# Altium project Cosmic_Nova_Board_Alpha_V0.00.PrjPcb
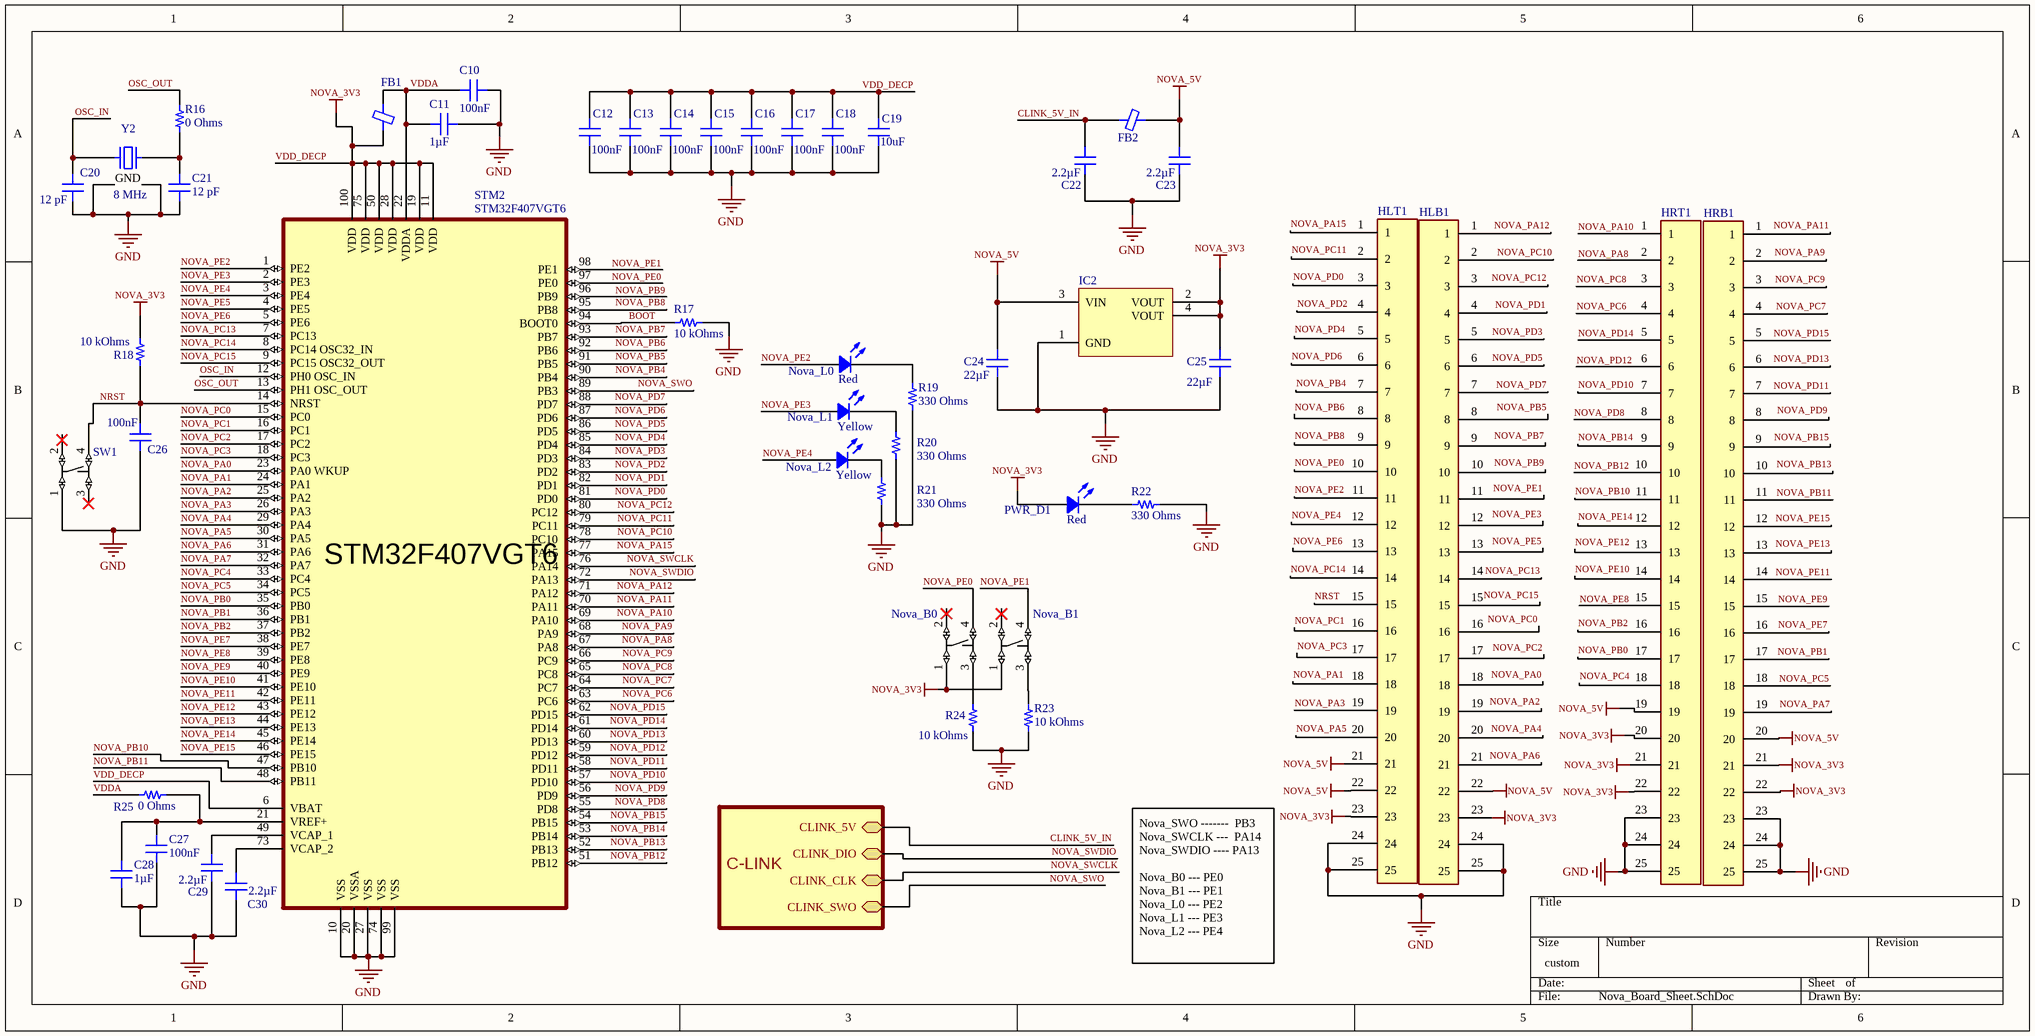
[diagram p0: Nova_Board_Sheet.SchDoc]
2 sheets, 83 parts. Net scope: hierarchical (ports join the sheet entries above them; power ports are global).
Board file: Nova_Board_PCB_D0.PcbDoc
Sheets:
  Nova_Board_Sheet.SchDoc
    U_Cosmolink_Sheet = Cosmolink_Sheet.SchDoc

## Sheet Nova_Board_Sheet.SchDoc
size 381 x 193 mm

### Parts
C10  Capacitance: 100nF  [CAP 0603_1608]  (hidden comment: 0.1µF)
C11  1µF  [CAP 0603_1608]
C12  Capacitance: 100nF  [CAP 0603_1608]  (hidden comment: 0.1µF)
C13  Capacitance: 100nF  [CAP 0603_1608]  (hidden comment: 0.1µF)
C14  Capacitance: 100nF  [CAP 0603_1608]  (hidden comment: 0.1µF)
C15  Capacitance: 100nF  [CAP 0603_1608]  (hidden comment: 0.1µF)
C16  Capacitance: 100nF  [CAP 0603_1608]  (hidden comment: 0.1µF)
C17  Capacitance: 100nF  [CAP 0603_1608]  (hidden comment: 0.1µF)
C18  Capacitance: 100nF  [CAP 0603_1608]  (hidden comment: 0.1µF)
C19  Capacitance: 10uF  [CAP 0603_1608]  (hidden comment: 10µF)
C20  12 pF  [CAP 0603_1608]
C21  12 pF  [CAP 0603_1608]
C22  2.2µF  [CAP 0603_1608]
C23  2.2µF  [CAP 0603_1608]
C24  22µF  [CAP 0805_2012]
C25  22µF  [CAP 0805_2012]
C26  Capacitance: 100nF  [CAP 0603_1608]  (hidden comment: 0.1µF)
C27  Capacitance: 100nF  [CAP 0603_1608]  (hidden comment: 0.1µF)
C28  1µF  [CAP 0603_1608]
C29  2.2µF  [CAP 0603_1608]
C30  2.2µF  [CAP 0603_1608]
FB1  600 Ohms @ 100MHz  [FER 0603_1608]  (value not drawn)
FB2  600 Ohms @ 100MHz  [FER 0603_1608]  (value not drawn)
HLB1  2.54mm_TH_1x25_pin_header  [2.54mm_TH_1x25_pin_header]  (value not drawn)
HLT1  2.54mm_TH_1x25_pin_header  [2.54mm_TH_1x25_pin_header]  (value not drawn)
HRB1  2.54mm_TH_1x25_pin_header  [2.54mm_TH_1x25_pin_header]  (value not drawn)
HRT1  2.54mm_TH_1x25_pin_header  [2.54mm_TH_1x25_pin_header]  (value not drawn)
IC2  LDL1117S33R  [ST SOT-223]  (value not drawn)
Nova_B0  3x4x2.5_oval_switch  [3x4x2.5_oval_button_footprint]  (value not drawn)
Nova_B1  3x4x2.5_oval_switch  [3x4x2.5_oval_button_footprint]  (value not drawn)
Nova_L0  Red  [LED 0603_1608 RED]
Nova_L1  Yellow  [LED 0603_1608 YELLOW]
Nova_L2  Yellow  [LED 0603_1608 YELLOW]
PWR_D1  Red  [LED 0603_1608 RED]
R16  0 Ohms  [RES 0603_1608]
R17  10 kOhms  [RES 0603_1608]
R18  10 kOhms  [RES 0603_1608]
R19  330 Ohms  [RES 0603_1608]
R20  330 Ohms  [RES 0603_1608]
R21  330 Ohms  [RES 0603_1608]
R22  330 Ohms  [RES 0603_1608]
R23  10 kOhms  [RES 0603_1608]
R24  10 kOhms  [RES 0603_1608]
R25  0 Ohms  [RES 0603_1608]
STM2  STM32F407VGT6  [STM32F407VGT6_FOOTPRINT]
SW1  3x4x2.5_oval_switch  [3x4x2.5_oval_button_footprint]  (value not drawn)
Y2  8 MHz  [EPSON TSX-3225]

### Sub-sheets
U_Cosmolink_Sheet = Cosmolink_Sheet.SchDoc: CLINK_CLK (bidir), CLINK_DIO (bidir), CLINK_5V (bidir), CLINK_SWO (bidir)

### Nets
CLINK_5V_IN: C22.1 FB2.2 ; sheet U_Cosmolink_Sheet/CLINK_5V
GND: C10.1 C11.1 C12.2 C13.2 C14.2 C15.2 C16.2 C17.2 C18.2 C19.1 C20.1 C21.1 C22.2 C23.2 C24.1 C25.1 C26.1 C27.2 C28.2 C29.2 C30.2 HLB1.24 HLB1.25 HLT1.24 HLT1.25 HRB1.23 HRB1.24 HRB1.25 HRT1.23 HRT1.24 HRT1.25 IC2.1(GND) R17.1 R19.1 R20.1 R21.1 R22.2 R23.2 R24.2 STM2.10(VSS) STM2.20(VSSA) STM2.27(VSS) STM2.74(VSS) STM2.99(VSS) SW1.1 Y2.2(GND) Y2.4(GND)
NOVA_5V: C23.1 C24.2 FB2.1 HLB1.22 HLT1.21 HLT1.22 HRB1.20 HRT1.19 IC2.3(VIN)
VDD_DECP: C12.1 C13.1 C14.1 C15.1 C16.1 C17.1 C18.1 C19.2 C25.2 FB1.1 HLB1.23 HLT1.23 HRB1.21 HRB1.22 HRT1.20 HRT1.21 HRT1.22 IC2.2(VOUT) IC2.4(VOUT) Nova_B0.1 Nova_B1.1 PWR_D1.1 R18.1 STM2.6(VBAT) STM2.11(VDD) STM2.19(VDD) STM2.28(VDD) STM2.50(VDD) STM2.75(VDD) STM2.100(VDD)  [also labelled NOVA_3V3]
BOOT: R17.2 STM2.94(BOOT0)
NOVA_PA0: HLB1.18 STM2.23(PA0_WKUP)
NOVA_PA1: HLT1.18 STM2.24(PA1)
NOVA_PA2: HLB1.19 STM2.25(PA2)
NOVA_PA3: HLT1.19 STM2.26(PA3)
NOVA_PA4: HLB1.20 STM2.29(PA4)
NOVA_PA5: HLT1.20 STM2.30(PA5)
NOVA_PA6: HLB1.21 STM2.31(PA6)
NOVA_PA7: HRB1.19 STM2.32(PA7)
NOVA_PA8: HRT1.2 STM2.67(PA8)
NOVA_PA9: HRB1.2 STM2.68(PA9)
NOVA_PA10: HRT1.1 STM2.69(PA10)
NOVA_PA11: HRB1.1 STM2.70(PA11)
NOVA_PA12: HLB1.1 STM2.71(PA12)
NOVA_PA15: HLT1.1 STM2.77(PA15)
NOVA_PB0: HRT1.17 STM2.35(PB0)
NOVA_PB1: HRB1.17 STM2.36(PB1)
NOVA_PB2: HRT1.16 STM2.37(PB2)
NOVA_PB4: HLT1.7 STM2.90(PB4)
NOVA_PB5: HLB1.8 STM2.91(PB5)
NOVA_PB6: HLT1.8 STM2.92(PB6)
NOVA_PB7: HLB1.9 STM2.93(PB7)
NOVA_PB8: HLT1.9 STM2.95(PB8)
NOVA_PB9: HLB1.10 STM2.96(PB9)
NOVA_PB10: HRT1.11 STM2.47(PB10)
NOVA_PB11: HRB1.11 STM2.48(PB11)
NOVA_PB12: HRT1.10 STM2.51(PB12)
NOVA_PB13: HRB1.10 STM2.52(PB13)
NOVA_PB14: HRT1.9 STM2.53(PB14)
NOVA_PB15: HRB1.9 STM2.54(PB15)
NOVA_PC0: HLB1.16 STM2.15(PC0)
NOVA_PC1: HLT1.16 STM2.16(PC1)
NOVA_PC2: HLB1.17 STM2.17(PC2)
NOVA_PC3: HLT1.17 STM2.18(PC3)
NOVA_PC4: HRT1.18 STM2.33(PC4)
NOVA_PC5: HRB1.18 STM2.34(PC5)
NOVA_PC6: HRT1.4 STM2.63(PC6)
NOVA_PC7: HRB1.4 STM2.64(PC7)
NOVA_PC8: HRT1.3 STM2.65(PC8)
NOVA_PC9: HRB1.3 STM2.66(PC9)
NOVA_PC10: HLB1.2 STM2.78(PC10)
NOVA_PC11: HLT1.2 STM2.79(PC11)
NOVA_PC12: HLB1.3 STM2.80(PC12)
NOVA_PC13: HLB1.14 STM2.7(PC13)
NOVA_PC14: HLT1.14 STM2.8(PC14_OSC32_IN)
NOVA_PC15: HLB1.15 STM2.9(PC15_OSC32_OUT)
NOVA_PD0: HLT1.3 STM2.81(PD0)
NOVA_PD1: HLB1.4 STM2.82(PD1)
NOVA_PD2: HLT1.4 STM2.83(PD2)
NOVA_PD3: HLB1.5 STM2.84(PD3)
NOVA_PD4: HLT1.5 STM2.85(PD4)
NOVA_PD5: HLB1.6 STM2.86(PD5)
NOVA_PD6: HLT1.6 STM2.87(PD6)
NOVA_PD7: HLB1.7 STM2.88(PD7)
NOVA_PD8: HRT1.8 STM2.55(PD8)
NOVA_PD9: HRB1.8 STM2.56(PD9)
NOVA_PD10: HRT1.7 STM2.57(PD10)
NOVA_PD11: HRB1.7 STM2.58(PD11)
NOVA_PD12: HRT1.6 STM2.59(PD12)
NOVA_PD13: HRB1.6 STM2.60(PD13)
NOVA_PD14: HRT1.5 STM2.61(PD14)
NOVA_PD15: HRB1.5 STM2.62(PD15)
NOVA_PE0: HLT1.10 Nova_B0.4 STM2.97(PE0)
NOVA_PE1: HLB1.11 Nova_B1.4 STM2.98(PE1)
NOVA_PE2: HLT1.11 Nova_L0.1 STM2.1(PE2)
NOVA_PE3: HLB1.12 Nova_L1.1 STM2.2(PE3)
NOVA_PE4: HLT1.12 Nova_L2.1 STM2.3(PE4)
NOVA_PE5: HLB1.13 STM2.4(PE5)
NOVA_PE6: HLT1.13 STM2.5(PE6)
NOVA_PE7: HRB1.16 STM2.38(PE7)
NOVA_PE8: HRT1.15 STM2.39(PE8)
NOVA_PE9: HRB1.15 STM2.40(PE9)
NOVA_PE10: HRT1.14 STM2.41(PE10)
NOVA_PE11: HRB1.14 STM2.42(PE11)
NOVA_PE12: HRT1.13 STM2.43(PE12)
NOVA_PE13: HRB1.13 STM2.44(PE13)
NOVA_PE14: HRT1.12 STM2.45(PE14)
NOVA_PE15: HRB1.12 STM2.46(PE15)
NOVA_SWCLK: STM2.76(PA14) ; sheet U_Cosmolink_Sheet/CLINK_CLK
NOVA_SWDIO: STM2.72(PA13) ; sheet U_Cosmolink_Sheet/CLINK_DIO
NOVA_SWO: STM2.89(PB3) ; sheet U_Cosmolink_Sheet/CLINK_SWO
NRST: C26.2 HLT1.15 R18.2 STM2.14(NRST) SW1.4
OSC_IN: C20.2 STM2.12(PH0_OSC_IN) Y2.1
OSC_OUT: R16.2 STM2.13(PH1_OSC_OUT)
VDDA: C10.2 C11.2 FB1.2 R25.1 STM2.22(VDDA)
NetC21_2: C21.2 R16.1 Y2.3
NetC27_1: C27.1 C28.1 R25.2 STM2.21(VREF+)
NetC29_1: C29.1 STM2.49(VCAP_1)
NetC30_1: C30.1 STM2.73(VCAP_2)
NetNova_B0_3: Nova_B0.3 R24.1
NetNova_B1_3: Nova_B1.3 R23.1
NetNova_L0_2: Nova_L0.2 R19.2
NetNova_L1_2: Nova_L1.2 R20.2
NetNova_L2_2: Nova_L2.2 R21.2
NetPWR_D1_2: PWR_D1.2 R22.1

Not connected (* = marked no-connect by the designer): Nova_B0 2*; Nova_B1 2*; SW1 2* 3*

### Notes on the sheet
- C-LINK
- Nova_SWO -------  PB3
  Nova_SWCLK ---  PA14
  Nova_SWDIO ---- PA13
  Nova_B0 --- PE0
  Nova_B1 --- PE1
  Nova_L0 --- PE2
  Nova_L1 --- PE3
  Nova_L2 --- PE4

### Library data of the parts
C10-C19 C22 C23 C26-C30 = 06031C104KAT2A: CAP CER 0.1UF 100V X7R 0603; manufacturer: AVX Corporation; Tolerance: ±10%; Part Number: 06031C104KAT2A; Applications: General Purpose; componentlink1description: Datasheet; componentlink1url: http://datasheets.avx.com/X7RDielectric.pdf; componentlink2description: DigiKey Link; componentlink2url: http://digikey.com/product-detail/en/avx-corporation/06031C104KAT2A/478-10047-1-ND/6564270; Device Package: 0603 (1608 Metric); lastupdated: 9/2/2020 1:03:14 AM; Lifecycle Status: Active; Minimum Order: 1; Mounting Type: Surface Mount, MLCC; Operating Temperature: -55°C ~ 125°C; Package / Case: 0603 (1608 Metric); packaging: TapeAndReel; partid: 14077; Part Status: Active; price: 0.03; series: -; Size / Dimension: 0.063" L x 0.032" W (1.60mm x 0.81mm); Supplier 1: DigiKey; Supplier Part Number 1: 478-10047-1-ND; Temperature Coefficient: X7R; Thickness (Max): 0.037" (0.94mm); Voltage - Rated: 100V
  C10 C12-C18 C26 C27: value: 0.1µF
  C11 C28: Capacitance: 1µF; value: 1µF
  C19: value: 10µF
  C22 C23 C29 C30: Capacitance: 2.2µF; value: 2.2µF
C20 C21 = C06CF220F-9ZN-X0T: HIGH-Q MLCC (CF): 0603, 22 PF (1; manufacturer: Knowles Dielectric Labs; Temperature Coefficient: C0G, NP0; Tolerance: ±1%; Voltage - Rated: 250V; Part Number: C06CF220F-9ZN-X0T; Capacitance: 12 pF; Applications: RF, Microwave, High Frequency; componentlink1description: Datasheet; componentlink1url: https://media.digikey.com/pdf/Data%20Sheets/Knowles%20Dielectric%20Labs%20PDFs/MLC_SLC_Cap_Cat.pdf; componentlink2description: DigiKey Link; componentlink2url: https://www.digikey.com/en/products/detail/knowles-dielectric-labs/C06CF220F-9ZN-X0T/19203937; Device Package: 0603 (1608 Metric); Features: High Q, Low Loss; lastupdated: 2/9/2024 8:08:55 PM; Lifecycle Status: Active; Minimum Order: 1; Mounting Type: Surface Mount, MLCC; Operating Temperature: -55°C ~ 125°C; Package / Case: 0603 (1608 Metric); packaging: TapeAndReel; partid: 55085; Part Status: Active; price: 2.56; series: CF; Size / Dimension: 0.060" L x 0.030" W (1.52mm x 0.76mm); Supplier 1: DigiKey; Supplier Part Number 1: 1761-C06CF220F-9ZN-X0TCT-ND; Thickness (Max): 0.031" (0.80mm); value: 12 pF
C24 C25 = 0805ZD226MAT2A: CAP CER 22UF 10V X5R 0805; manufacturer: AVX Corporation; Tolerance: ±20%; Part Number: 0805ZD226MAT2A; Capacitance: 22µF; Applications: General Purpose; componentlink1description: Datasheet; componentlink1url: http://datasheets.avx.com/cx5r.pdf; componentlink2description: DigiKey Link; componentlink2url: http://digikey.com/product-detail/en/avx-corporation/0805ZD226MAT2A/478-7966-1-ND/3881589; Device Package: 0805 (2012 Metric); lastupdated: 9/2/2020 1:04:32 AM; Lifecycle Status: Active; Minimum Order: 1; Mounting Type: Surface Mount, MLCC; Operating Temperature: -55°C ~ 85°C; Package / Case: 0805 (2012 Metric); packaging: TapeAndReel; partid: 7750; Part Status: Active; price: 0.10; series: -; Size / Dimension: 0.079" L x 0.049" W (2.00mm x 1.25mm); Supplier 1: DigiKey; Supplier Part Number 1: 478-7966-1-ND; Temperature Coefficient: X5R; Thickness (Max): 0.060" (1.52mm); value: 22µF; Voltage - Rated: 10V
FB1 FB2 = BLM18DN601SZ1D: FERRITEBEAD SMD Z100MHZ=600OHM 7; Manufacturer: Murata Electronics; Current Rating (Max): 700mA; Number of Lines: 1; Part Number: BLM18DN601SZ1D; ComponentLink1Description: Datasheet; ComponentLink1URL: https://www.murata.com/en-us/api/pdfdownloadapi?cate=luNoiseSupprFilteChipFerriBead&partno=BLM18DN601SZ1%23; ComponentLink2Description: DigiKey Link; ComponentLink2URL: http://digikey.com/product-detail/en/murata-electronics/BLM18DN601SZ1D/490-18575-1-ND/10135586; Device Package: 0603 (1608 Metric); Height (Max): 0.037" (0.95mm); Impedance @ Frequency: 600 Ohms @ 100MHz; LastUpdated: 9/2/2020 1:18:18 AM; Lifecycle Status: Active; Minimum Order: 1; Mounting Type: Surface Mount; Operating Temperature: -55°C ~ 125°C; Package / Case: 0603 (1608 Metric); Packaging: TapeAndReel; PartId: 783; Part Status: Active; Price: 0.05; Ratings: AEC-Q200; Series: EMIFIL®, BLM18; Size / Dimension: 0.063" L x 0.031" W (1.60mm x 0.80mm); Supplier 1: DigiKey; Supplier Part Number 1: 490-18575-1-ND; Value: 600 Ohms @ 100MHz
IC2 = LDL1117S33R: IC REG LINEAR 3.3V 1.2A SOT223; Manufacturer: STMicroelectronics; Current - Quiescent (Iq): 500 µA; Number of Regulators: 1; Output Configuration: Positive; Output Type: Fixed; Protection Features: Over Current, Over Temperature, Under Voltage Lockout (UVLO); PSRR: 87dB ~ 65dB (120Hz ~ 100kHz); Voltage Dropout (Max): 0.6V @ 1.2A; Voltage - Input (Max): 18V; Part Number: LDL1117S33R; ComponentLink1Description: Datasheet; ComponentLink1URL: http://www.st.com/content/ccc/resource/technical/document/datasheet/group3/0e/5a/00/ca/10/1a/4f/a5/DM00366442/files/DM00366442.pdf/jcr:content/translations/en.DM00366442.pdf; ComponentLink2Description: DigiKey Link; ComponentLink2URL: https://www.digikey.com/en/products/detail/stmicroelectronics/LDL1117S33R/7102071; Current - Output: 1.2A; LastUpdated: 6/3/2024 8:25:59 PM; Lifecycle Status: Active; Minimum Order: 1; Mounting Type: Surface Mount; Operating Temperature: -40°C ~ 125°C (TJ); Package / Case: TO-261-4, TO-261AA; Packaging: TapeAndReel; Part Status: Active; Price: 0.31; Series: -; Supplier 1: DigiKey; Supplier Part Number 1: 497-17239-1-ND; Supplier Device Package: SOT-223; Voltage - Output (Min/Fixed): 3.3V
Nova_L0 PWR_D1 = VFHR1111C-3BY2A-TR: LED RED DIFFUSED 1608 SMD; Manufacturer: Stanley Electric Co; Configuration: Standard; Current - Test: 20mA; Lens Color: White; Lens Size: 1.10mm x 0.80mm; Lens Style: Rectangle with Flat Top; Millicandela Rating: 91mcd; Viewing Angle: 140°; Voltage - Forward (Vf) (Typ): 1.9V; Wavelength - Dominant: 626nm; Wavelength - Peak: 635nm; Part Number: VFHR1111C-3BY2A-TR; Color: Red; ComponentLink1Description: Datasheet; ComponentLink1URL: http://www.stanley-components.com/php/downloaddatafile.php?rp=0,VFHR1111C-3BY2A-TR_e.pdf; ComponentLink2Description: DigiKey Link; ComponentLink2URL: https://www.digikey.com/en/products/detail/stanley-electric-co/VFHR1111C-3BY2A-TR/6615658; Device Package: 0603 (1608 Metric); Height (Max): 0.80mm; LastUpdated: 6/3/2024 7:59:48 PM; Lens Transparency: Diffused; Lifecycle Status: Active; Minimum Order: 1; Mounting Type: Surface Mount; Package / Case: 0603 (1608 Metric); Packaging: TapeAndReel; PartId: 373; Part Status: Active; Price: 0.06; Series: -; Size / Dimension: 1.60mm L x 0.80mm W; Supplier 1: DigiKey; Supplier Part Number 1: 404-1310-1-ND; Supplier Device Package: 1608; Value: Red
Nova_L1 Nova_L2 = 5973405507F: LED YELLOW 0603 SMD; Manufacturer: Dialight; Configuration: Standard; Current - Test: 20mA; Lens Color: 0.68mm; Lens Size: 1.20mm x 0.80mm; Lens Style: Rectangle with Flat Top; Millicandela Rating: 224mcd; Voltage - Forward (Vf) (Typ): 2.1V; Wavelength - Dominant: 590nm; Part Number: 5973405507F; Color: Yellow; ComponentLink1Description: Datasheet; ComponentLink1URL: http://www.dialightsignalsandcomponents.com/Assets/Drawings/2D_Drawings_DrawingDetailedSpec/NewDrawings/18369A.pdf; ComponentLink2Description: DigiKey Link; ComponentLink2URL: https://www.digikey.com/en/products/detail/dialight/5973405507F/9385433; Device Package: 0603 (1608 Metric); Height (Max): 0.68mm; LastUpdated: 6/3/2024 8:01:10 PM; Lifecycle Status: Active; Minimum Order: 1; Mounting Type: Surface Mount; Package / Case: 0603 (1608 Metric); Packaging: TapeAndReel; PartId: 87; Part Status: Active; Price: 0.08; Series: 597; Size / Dimension: 1.60mm L x 0.80mm W; Supplier 1: DigiKey; Supplier Part Number 1: 350-4378-1-ND; Supplier Device Package: 0603; Value: Yellow
R16 R25 = TLRZ1JTTD: RES 0 OHM JUMPER 0603; Manufacturer: KOA Speer Electronics, Inc.; Part Number: TLRZ1JTTD; Value: 0 Ohms; ComponentLink1Description: Datasheet; ComponentLink1URL: http://www.koaspeer.com/catimages/Products/TLRZ/TLRZ.pdf; ComponentLink2Description: DigiKey Link; ComponentLink2URL: https://www.digikey.com/en/products/detail/koa-speer-electronics-inc/TLRZ1JTTD/9845493; Composition: Metal Element; Device Package: 0603 (1608 Metric); Features: Automotive AEC-Q200, Current Sense; Height - Seated (Max): 0.022" (0.55mm); LastUpdated: 2/9/2024 8:43:37 PM; Lifecycle Status: Active; Minimum Order: 1; Number of Terminations: 2; Operating Temperature: -55°C ~ 170°C; Package / Case: 0603 (1608 Metric); Packaging: TapeAndReel; PartId: 4851; Part Status: Active; Price: 0.08; Ratings: AEC-Q200; Resistance: 0 Ohms; Series: TLRZ; Size / Dimension: 0.063" L x 0.031" W (1.60mm x 0.80mm); Supplier 1: DigiKey; Supplier Part Number 1: 2019-TLRZ1JTTDCT-ND; Supplier Device Package: 0603; Tolerance: Jumper
R17 R18 R23 R24 = RNCS0603BKE10K0: RES 10K OHM 0.1% 1/16W 0603; Manufacturer: Stackpole Electronics Inc; Power (Watts): 0.063W, 1/16W; Temperature Coefficient: ±25ppm/°C; Part Number: RNCS0603BKE10K0; Value: 10 kOhms; ComponentLink1Description: Datasheet; ComponentLink1URL: https://www.seielect.com/catalog/sei-rncs_rnch.pdf; ComponentLink2Description: DigiKey Link; ComponentLink2URL: https://www.digikey.com/en/products/detail/stackpole-electronics-inc/RNCS0603BKE10K0/1708836; Composition: Thin Film; Device Package: 0603 (1608 Metric); Features: Anti-Corrosive, Automotive AEC-Q200, Moisture Resistant; Height - Seated (Max): 0.022" (0.55mm); LastUpdated: 2/9/2024 8:43:37 PM; Lifecycle Status: Active; Minimum Order: 1; Number of Terminations: 2; Operating Temperature: -55°C ~ 155°C; Package / Case: 0603 (1608 Metric); Packaging: TapeAndReel; PartId: 4838; Part Status: Active; Price: 0.06; Ratings: AEC-Q200; Resistance: 10 kOhms; Series: RNCS; Size / Dimension: 0.061" L x 0.031" W (1.55mm x 0.80mm); Supplier 1: DigiKey; Supplier Part Number 1: RNCS0603BKE10K0CT-ND; Supplier Device Package: 0603; Tolerance: ±0.1%
R19-R22 = RNCS0603BKE10K0: RES 10K OHM 0.1% 1/16W 0603; Manufacturer: Stackpole Electronics Inc; Power (Watts): 0.063W, 1/16W; Resistance: 100 kOhms; Temperature Coefficient: ±25ppm/°C; Part Number: RNCS0603BKE10K0; Value: 330 Ohms; ComponentLink1Description: Datasheet; ComponentLink1URL: https://www.seielect.com/catalog/sei-rncs_rnch.pdf; ComponentLink2Description: DigiKey Link; ComponentLink2URL: https://www.digikey.com/en/products/detail/stackpole-electronics-inc/RNCS0603BKE10K0/1708836; Composition: Thin Film; Device Package: 0603 (1608 Metric); Features: Anti-Corrosive, Automotive AEC-Q200, Moisture Resistant; Height - Seated (Max): 0.022" (0.55mm); LastUpdated: 2/9/2024 8:43:37 PM; Lifecycle Status: Active; Minimum Order: 1; Number of Terminations: 2; Operating Temperature: -55°C ~ 155°C; Package / Case: 0603 (1608 Metric); Packaging: TapeAndReel; PartId: 4838; Part Status: Active; Price: 0.06; Ratings: AEC-Q200; Series: RNCS; Size / Dimension: 0.061" L x 0.031" W (1.55mm x 0.80mm); Supplier 1: DigiKey; Supplier Part Number 1: RNCS0603BKE10K0CT-ND; Supplier Device Package: 0603; Tolerance: ±0.1%
STM2 = STM32F407VGT6: 1MB 1.8V~3.6V ARM-M4 192KB 168MHz FLASH 82 LQFP-100(14x14) Microcontrollers (MCU/MPU/SOC) ROHS; JLCPCB Part #: C12345; Package: LQFP-100(14x14); MFR.Part #: STM32F407VGT6; ComponentLink1Description: Datasheet; ComponentLink1URL: https://www.st.com/resource/en/datasheet/dm00037051.pdf; ComponentLink2Description: JLCPCB Parts; ComponentLink2URL: https://jlcpcb.com/partdetail/Stmicroelectronics-STM32F407VGT6/C12345
Y2 = TSX-3225 16.0000MF10U-B0: CRYSTAL 16.0000MHZ 16PF SMD; Manufacturer: EPSON; ESR (Equivalent Series Resistance): 60 Ohms; Frequency: 16 MHz; Frequency Stability: ±10ppm; Operating Mode: Fundamental; Part Number: TSX-3225 16.0000MF10U-B0; ComponentLink1Description: Datasheet; ComponentLink1URL: https://support.epson.biz/td/api/doc_check.php?dl=brief_TSX-3225&lang=en; ComponentLink2Description: DigiKey Link; ComponentLink2URL: https://www.digikey.com/en/products/detail/epson/TSX-3225-16-0000MF10U-B0/5260851; Frequency Tolerance: ±10ppm; Height - Seated (Max): 0.024" (0.60mm); LastUpdated: 6/3/2024 8:02:15 PM; Lifecycle Status: Active; Load Capacitance: 16pF; Minimum Order: 1; Mounting Type: Surface Mount; Operating Temperature: -10°C ~ 60°C; Package / Case: 4-SMD, No Lead; Packaging: TapeAndReel; PartId: 436; Part Status: Active; Price: 0.20; Series: TSX-3225; Size / Dimension: 0.126" L x 0.098" W (3.20mm x 2.50mm); Supplier 1: DigiKey; Supplier Part Number 1: SER4370CT-ND; Type: MHz Crystal; Value: 8 MHz

## Sheet Cosmolink_Sheet.SchDoc
size A
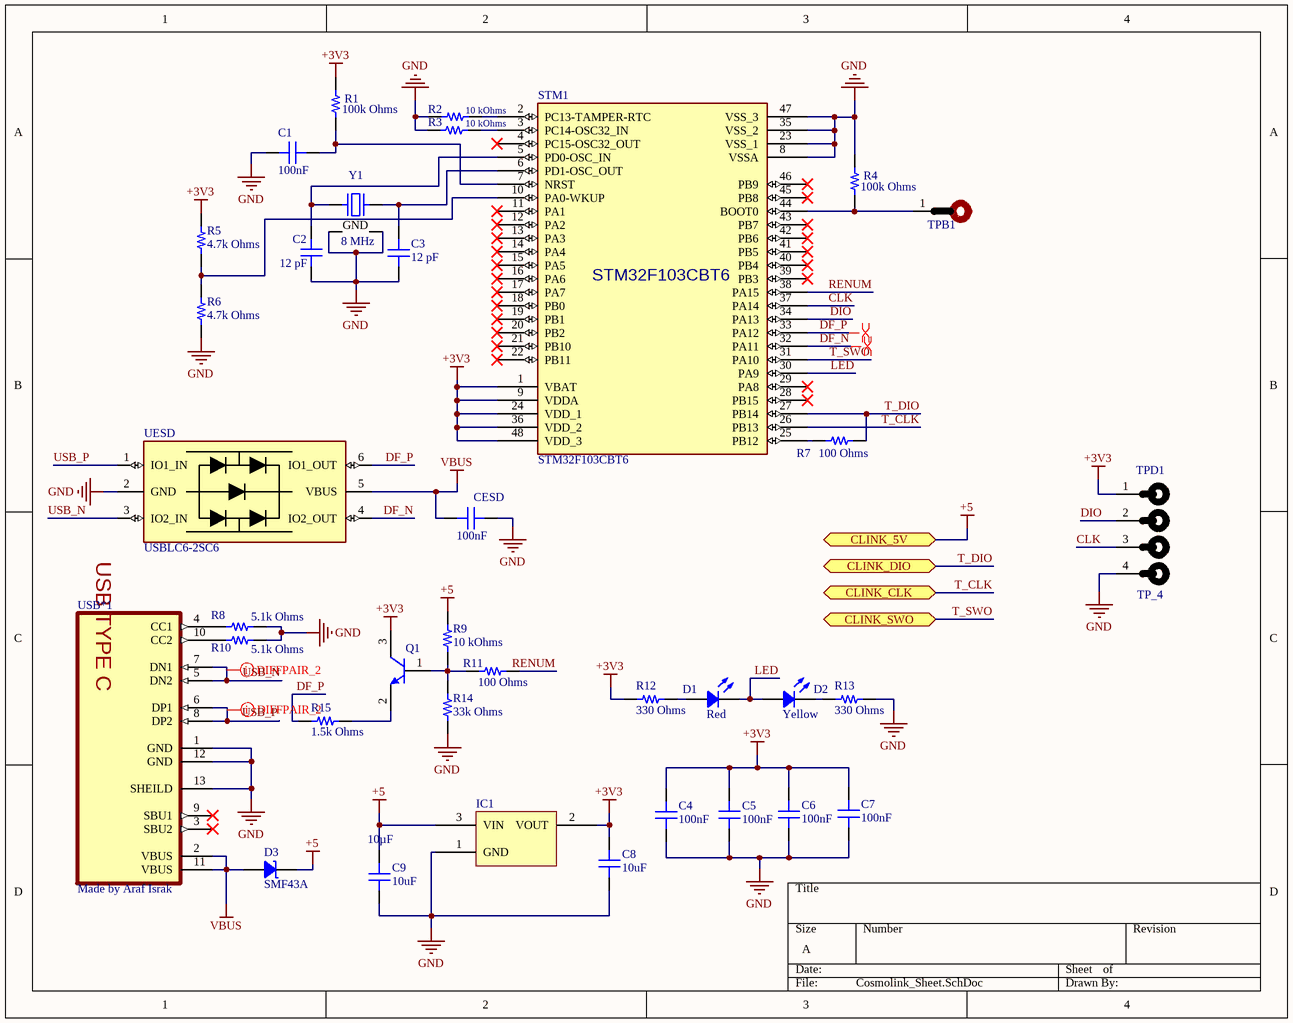
[diagram p1: Cosmolink_Sheet.SchDoc]

### Parts
C1  Capacitance: 100nF  [CAP 0603_1608]  (hidden comment: 0.1µF)
C2  12 pF  [CAP 0603_1608]
C3  12 pF  [CAP 0603_1608]
C4  Capacitance: 100nF  [CAP 0603_1608]  (hidden comment: 0.1µF)
C5  Capacitance: 100nF  [CAP 0603_1608]  (hidden comment: 0.1µF)
C6  Capacitance: 100nF  [CAP 0603_1608]  (hidden comment: 0.1µF)
C7  Capacitance: 100nF  [CAP 0603_1608]  (hidden comment: 0.1µF)
C8  Capacitance: 10uF  [CAP 0603_1608]  (hidden comment: 10µF)
C9  Capacitance: 10uF  [CAP 0603_1608]  (hidden comment: 10µF)
CESD  Capacitance: 100nF  [CAP 0603_1608]  (hidden comment: 0.1µF)
D1  Red  [LED 0603_1608 RED]
D2  Yellow  [LED 0603_1608 YELLOW]
D3  SMF43A  [SOD123F]
IC1  AP2138N-3.3TRG1  [DIODES SOT-23-3 N]  (value not drawn)
Q1  DNLS160-7  [DIODES SOT-23-3]  (value not drawn)
R1  100k Ohms  [RES 0603_1608]
R2  10 kOhms  [RES 0603_1608]
R3  10 kOhms  [RES 0603_1608]
R4  100k Ohms  [RES 0603_1608]
R5  4.7k Ohms  [RES 0603_1608]
R6  4.7k Ohms  [RES 0603_1608]
R7  100 Ohms  [RES 0603_1608]
R8  5.1k Ohms  [RES 0603_1608]
R9  10 kOhms  [RES 0603_1608]
R10  5.1k Ohms  [RES 0603_1608]
R11  100 Ohms  [RES 0603_1608]
R12  330 Ohms  [RES 0603_1608]
R13  330 Ohms  [RES 0603_1608]
R14  33k Ohms  [RES 0603_1608]
R15  1.5k Ohms  [RES 0603_1608]
STM1  STM32F103CBT6  [STM32F103CBT6_FOOTPRINT]
TPB1  TP_1  [TP1]  (value not drawn)
TPD1  TP_4  [TP4]
UESD  USBLC6-2SC6  [USBLC6-2SC6_Footprint]
USB*1  Made by Araf Israk  [USB TYPE-C 24P SMD]
Y1  8 MHz  [EPSON TSX-3225]

### Ports
CLINK_5V (bidir), CLINK_CLK (bidir), CLINK_DIO (bidir), CLINK_SWO (bidir)

### Nets
+3V3: C4.2 C5.2 C6.2 C7.2 C8.2 IC1.2(VOUT) Q1.3(C) R1.1 R5.2 R12.1 STM1.1(VBAT) STM1.9(VDDA) STM1.24(VDD_1) STM1.36(VDD_2) STM1.48(VDD_3) TPD1.1(TP1)
+5: C9.2 D3.2 IC1.3(VIN) R9.2 ; port CLINK_5V  [project net CLINK_5V_IN]
GND: C1.1 C2.1 C3.1 C4.1 C5.1 C6.1 C7.1 C8.1 C9.1 CESD.1 IC1.1(GND) R2.1 R3.1 R4.1 R6.1 R8.2 R10.2 R13.2 R14.1 STM1.8(VSSA) STM1.23(VSS_1) STM1.35(VSS_2) STM1.47(VSS_3) TPD1.4(TP4) UESD.2(GND) USB*1.1(GND) USB*1.12(GND) USB*1.13(SHEILD) Y1.2(GND) Y1.4(GND)
VBUS: CESD.2 D3.1 UESD.5(VBUS) USB*1.2(VBUS) USB*1.11(VBUS)
CLK: STM1.37(PA14) TPD1.3(TP3)
DF_N: STM1.32(PA11) UESD.4(IO2_OUT)
DF_P: R15.1 STM1.33(PA12) UESD.6(IO1_OUT)
DIO: STM1.34(PA13) TPD1.2(TP2)
LED: D1.2 D2.1 STM1.30(PA9)
RENUM: R11.2 STM1.38(PA15)
T_CLK: STM1.26(PB13) ; port CLINK_CLK  [project net NOVA_SWCLK]
T_DIO: R7.2 STM1.27(PB14) ; port CLINK_DIO  [project net NOVA_SWDIO]
T_SWO: STM1.31(PA10) ; port CLINK_SWO  [project net NOVA_SWO]
USB_N: UESD.3(IO2_IN) USB*1.5(DN2) USB*1.7(DN1)
USB_P: UESD.1(IO1_IN) USB*1.6(DP1) USB*1.8(DP2)
NetC1_2: C1.2 R1.2 STM1.7(NRST)
NetC2_2: C2.2 STM1.5(PD0-OSC_IN) Y1.1
NetC3_2: C3.2 STM1.6(PD1-OSC_OUT) Y1.3
NetD1_1: D1.1 R12.2
NetD2_2: D2.2 R13.1
NetQ1_1: Q1.1(B) R9.1 R11.1 R14.2
NetQ1_2: Q1.2(E) R15.2
NetR2_2: R2.2 STM1.2(PC13-TAMPER-RTC)
NetR3_2: R3.2 STM1.3(PC14-OSC32_IN)
NetR4_2: R4.2 STM1.44(BOOT0) TPB1.1(TP1)
NetR5_1: R5.1 R6.2 STM1.10(PA0-WKUP)
NetR7_1: R7.1 STM1.25(PB12)
NetR8_1: R8.1 USB*1.4(CC1)
NetR10_1: R10.1 USB*1.10(CC2)

Not connected (* = marked no-connect by the designer): STM1 4(PC15-OSC32_OUT)* 11(PA1)* 12(PA2)* 13(PA3)* 14(PA4)* 15(PA5)* 16(PA6)* 17(PA7)* 18(PB0)* 19(PB1)* 20(PB2)* 21(PB10)* 22(PB11)* 28(PB15)* 29(PA8)* 39(PB3)* 40(PB4)* 41(PB5)* 42(PB6)* 43(PB7)* 45(PB8)* 46(PB9)*; USB*1 3(SBU2)* 9(SBU1)*

### Layout directives
differential pair: DF_N, DF_P, USB_N, USB_P

### Notes on the sheet
- (in symbol USB TYPE-C 24P SMD) USB TYPE C

### Library data of the parts
C1 C4-C9 CESD = 06031C104KAT2A: as C10 on sheet Nova_Board_Sheet; Part Number: 06031C104KAT2A; Applications: General Purpose; componentlink1description: Datasheet; componentlink1url: http://datasheets.avx.com/X7RDielectric.pdf; componentlink2description: DigiKey Link; componentlink2url: http://digikey.com/product-detail/en/avx-corporation/06031C104KAT2A/478-10047-1-ND/6564270; Device Package: 0603 (1608 Metric); lastupdated: 9/2/2020 1:03:14 AM; Lifecycle Status: Active; Minimum Order: 1; Mounting Type: Surface Mount, MLCC; Operating Temperature: -55°C ~ 125°C; Package / Case: 0603 (1608 Metric); packaging: TapeAndReel; partid: 14077; Part Status: Active; price: 0.03; series: -; Size / Dimension: 0.063" L x 0.032" W (1.60mm x 0.81mm); Supplier 1: DigiKey; Supplier Part Number 1: 478-10047-1-ND; Temperature Coefficient: X7R; Thickness (Max): 0.037" (0.94mm); Voltage - Rated: 100V
  C1 C4-C7 CESD: value: 0.1µF
  C8 C9: value: 10µF
C2 C3 = C06CF220F-9ZN-X0T: as C20 on sheet Nova_Board_Sheet; Part Number: C06CF220F-9ZN-X0T; Capacitance: 12 pF; Applications: RF, Microwave, High Frequency; componentlink1description: Datasheet; componentlink1url: https://media.digikey.com/pdf/Data%20Sheets/Knowles%20Dielectric%20Labs%20PDFs/MLC_SLC_Cap_Cat.pdf; componentlink2description: DigiKey Link; componentlink2url: https://www.digikey.com/en/products/detail/knowles-dielectric-labs/C06CF220F-9ZN-X0T/19203937; Device Package: 0603 (1608 Metric); Features: High Q, Low Loss; lastupdated: 2/9/2024 8:08:55 PM; Lifecycle Status: Active; Minimum Order: 1; Mounting Type: Surface Mount, MLCC; Operating Temperature: -55°C ~ 125°C; Package / Case: 0603 (1608 Metric); packaging: TapeAndReel; partid: 55085; Part Status: Active; price: 2.56; series: CF; Size / Dimension: 0.060" L x 0.030" W (1.52mm x 0.76mm); Supplier 1: DigiKey; Supplier Part Number 1: 1761-C06CF220F-9ZN-X0TCT-ND; Thickness (Max): 0.031" (0.80mm); value: 12 pF
D1 = VFHR1111C-3BY2A-TR: as Nova_L0 on sheet Nova_Board_Sheet; Part Number: VFHR1111C-3BY2A-TR; Color: Red; ComponentLink1Description: Datasheet; ComponentLink1URL: http://www.stanley-components.com/php/downloaddatafile.php?rp=0,VFHR1111C-3BY2A-TR_e.pdf; ComponentLink2Description: DigiKey Link; ComponentLink2URL: https://www.digikey.com/en/products/detail/stanley-electric-co/VFHR1111C-3BY2A-TR/6615658; Device Package: 0603 (1608 Metric); Height (Max): 0.80mm; LastUpdated: 6/3/2024 7:59:48 PM; Lens Transparency: Diffused; Lifecycle Status: Active; Minimum Order: 1; Mounting Type: Surface Mount; Package / Case: 0603 (1608 Metric); Packaging: TapeAndReel; PartId: 373; Part Status: Active; Price: 0.06; Series: -; Size / Dimension: 1.60mm L x 0.80mm W; Supplier 1: DigiKey; Supplier Part Number 1: 404-1310-1-ND; Supplier Device Package: 1608; Value: Red
D2 = 5973405507F: as Nova_L1 on sheet Nova_Board_Sheet; Part Number: 5973405507F; Color: Yellow; ComponentLink1Description: Datasheet; ComponentLink1URL: http://www.dialightsignalsandcomponents.com/Assets/Drawings/2D_Drawings_DrawingDetailedSpec/NewDrawings/18369A.pdf; ComponentLink2Description: DigiKey Link; ComponentLink2URL: https://www.digikey.com/en/products/detail/dialight/5973405507F/9385433; Device Package: 0603 (1608 Metric); Height (Max): 0.68mm; LastUpdated: 6/3/2024 8:01:10 PM; Lifecycle Status: Active; Minimum Order: 1; Mounting Type: Surface Mount; Package / Case: 0603 (1608 Metric); Packaging: TapeAndReel; PartId: 87; Part Status: Active; Price: 0.08; Series: 597; Size / Dimension: 1.60mm L x 0.80mm W; Supplier 1: DigiKey; Supplier Part Number 1: 350-4378-1-ND; Supplier Device Package: 0603; Value: Yellow
D3 = SMF43A: TVS SOD123FL 43V 200W UNIDIR; Manufacturer: Littelfuse Inc.; Current - Peak Pulse (10/1000µs): 2.9A; Power Line Protection: No; Type: Zener; Unidirectional Channels: 1; Voltage - Breakdown (Min): 47.8V; Voltage - Clamping (Max) @ Ipp: 69.4V; Part Number: SMF43A; Applications: General Purpose; ComponentLink1Description: Datasheet; ComponentLink1URL: https://www.littelfuse.com/~/media/electronics/datasheets/tvs_diodes/littelfuse_tvs_diode_smf_datasheet.pdf.pdf; ComponentLink2Description: DigiKey Link; ComponentLink2URL: https://www.digikey.com/en/products/detail/littelfuse-inc/SMF43A/3672410; LastUpdated: 6/3/2024 8:22:37 PM; Lifecycle Status: Active; Minimum Order: 1; Mounting Type: Surface Mount; Operating Temperature: -55°C ~ 150°C (TJ); Package / Case: SOD-123F; Packaging: TapeAndReel; PartId: 10081; Part Status: Active; Power - Peak Pulse: 200W; Price: 0.08; Series: SMF; Supplier 1: DigiKey; Supplier Part Number 1: F5830CT-ND; Supplier Device Package: SOD-123F; Voltage - Reverse Standoff (Typ): 43V
IC1 = AP2138N-3.3TRG1: IC REG LINEAR 3.3V 250MA SOT23-3; Manufacturer: Diodes Incorporated; Current - Quiescent (Iq): 1.5 µA; Number of Regulators: 1; Output Configuration: Positive; Output Type: Fixed; Protection Features: Over Current; Voltage Dropout (Max): 0.6V @ 250mA; Voltage - Input (Max): 6V; Part Number: AP2138N-3.3TRG1; ComponentLink1Description: Datasheet; ComponentLink1URL: https://www.diodes.com/assets/Datasheets/AP2138-9.pdf; ComponentLink2Description: DigiKey Link; ComponentLink2URL: https://www.digikey.com/en/products/detail/diodes-incorporated/AP2138N-3-3TRG1/4470804; Current - Output: 250mA; LastUpdated: 6/3/2024 8:26:00 PM; Lifecycle Status: Active; Minimum Order: 1; Mounting Type: Surface Mount; Operating Temperature: -40°C ~ 85°C (TA); Package / Case: TO-236-3, SC-59, SOT-23-3; Packaging: TapeAndReel; Part Status: Active; Price: 0.08; Series: -; Supplier 1: DigiKey; Supplier Part Number 1: AP2138N-3.3TRG1DICT-ND; Supplier Device Package: SOT-23-3; Voltage - Output (Min/Fixed): 3.3V
Q1 = DNLS160-7: TRANS NPN 60V 1A SOT23-3; Manufacturer: Diodes Incorporated; Current - Collector Cutoff (Max): 100nA; DC Current Gain (hFE) (Min) @ Ic, Vce: 200 @ 500mA, 5V; Frequency - Transition: 270MHz; Power - Max: 300mW; Vce Saturation (Max) @ Ib, Ic: 250mV @ 100mA, 1A; Part Number: DNLS160-7; ComponentLink1Description: Datasheet; ComponentLink1URL: https://www.diodes.com/assets/Datasheets/ds31390.pdf; ComponentLink2Description: DigiKey Link; ComponentLink2URL: http://digikey.com/product-detail/en/diodes-incorporated/DNLS160-7/DNLS160DICT-ND/1964776; Current - Collector (Ic) (Max): 1A; LastUpdated: 6/3/2024 8:24:10 PM; Lifecycle Status: Active; Minimum Order: 1; Mounting Type: Surface Mount; Operating Temperature: -55°C ~ 150°C (TJ); Package / Case: TO-236-3, SC-59, SOT-23-3; Packaging: CutTape; PartId: 44; Part Status: Active; Price: 0.45; Series: -; Supplier 1: DigiKey; Supplier Part Number 1: DNLS160DICT-ND; Supplier Device Package: SOT-23-3; Transistor Type: NPN; Voltage - Collector Emitter Breakdown (Max): 60V
R1-R4 R9 = RNCS0603BKE10K0: as R17 on sheet Nova_Board_Sheet; Part Number: RNCS0603BKE10K0; ComponentLink1Description: Datasheet; ComponentLink1URL: https://www.seielect.com/catalog/sei-rncs_rnch.pdf; ComponentLink2Description: DigiKey Link; ComponentLink2URL: https://www.digikey.com/en/products/detail/stackpole-electronics-inc/RNCS0603BKE10K0/1708836; Composition: Thin Film; Device Package: 0603 (1608 Metric); Features: Anti-Corrosive, Automotive AEC-Q200, Moisture Resistant; Height - Seated (Max): 0.022" (0.55mm); LastUpdated: 2/9/2024 8:43:37 PM; Lifecycle Status: Active; Minimum Order: 1; Number of Terminations: 2; Operating Temperature: -55°C ~ 155°C; Package / Case: 0603 (1608 Metric); Packaging: TapeAndReel; PartId: 4838; Part Status: Active; Price: 0.06; Ratings: AEC-Q200; Series: RNCS; Size / Dimension: 0.061" L x 0.031" W (1.55mm x 0.80mm); Supplier 1: DigiKey; Supplier Part Number 1: RNCS0603BKE10K0CT-ND; Supplier Device Package: 0603; Tolerance: ±0.1%
  R1 R4: Value: 100k Ohms; Resistance: 100 kOhms
  R2 R3 R9: Value: 10 kOhms; Resistance: 10 kOhms
R5-R8 R10-R15 = RNCS0603BKE10K0: as R19 on sheet Nova_Board_Sheet; Part Number: RNCS0603BKE10K0; ComponentLink1Description: Datasheet; ComponentLink1URL: https://www.seielect.com/catalog/sei-rncs_rnch.pdf; ComponentLink2Description: DigiKey Link; ComponentLink2URL: https://www.digikey.com/en/products/detail/stackpole-electronics-inc/RNCS0603BKE10K0/1708836; Composition: Thin Film; Device Package: 0603 (1608 Metric); Features: Anti-Corrosive, Automotive AEC-Q200, Moisture Resistant; Height - Seated (Max): 0.022" (0.55mm); LastUpdated: 2/9/2024 8:43:37 PM; Lifecycle Status: Active; Minimum Order: 1; Number of Terminations: 2; Operating Temperature: -55°C ~ 155°C; Package / Case: 0603 (1608 Metric); Packaging: TapeAndReel; PartId: 4838; Part Status: Active; Price: 0.06; Ratings: AEC-Q200; Series: RNCS; Size / Dimension: 0.061" L x 0.031" W (1.55mm x 0.80mm); Supplier 1: DigiKey; Supplier Part Number 1: RNCS0603BKE10K0CT-ND; Supplier Device Package: 0603; Tolerance: ±0.1%
  R5 R6: Value: 4.7k Ohms
  R7 R11: Value: 100 Ohms
  R8 R10: Value: 5.1k Ohms
  R12 R13: Value: 330 Ohms
  R14: Value: 33k Ohms
  R15: Value: 1.5k Ohms
STM1 = STM32F103CBT6: 128KB 2V~3.6V ARM-M3 20KB 72MHz FLASH 37 LQFP-48(7x7) Microcontrollers (MCU/MPU/SOC) ROHS; JLCPCB Part #: C8304; Package: LQFP-48; MFR.Part #: STM32F103CBT6; ComponentLink1Description: Datasheet; ComponentLink1URL: https://www.st.com/resource/en/datasheet/cd00161566.pdf; ComponentLink2Description: JLCPCB Parts; ComponentLink2URL: https://jlcpcb.com/partdetail/Stmicroelectronics-STM32F103CBT6/C8304
UESD = USBLC6-2: The USBLC6-2SC6 and USBLC6-2P6 are / monolithic application specific devices dedicated / to ESD protection of high speed interfaces, such / as USB 2.0, Ethernet links and video lines. / The very low line capacitance secures a high level / of signal integrity without compromising in / protecting sensitive chips against the most / stringently characterized ESD strikes.; ComponentLink1Description: JLCPCB; ComponentLink1URL: https://jlcpcb.com/partdetail/Stmicroelectronics-USBLC62SC6/C7519; ComponentLink2Description: Datasheet; ComponentLink2URL: https://www.st.com/resource/en/datasheet/usblc6-2.pdf; JLCPCB Part #: C7519
USB*1 = USB TYPE-C 24P SMD: USB Type: TYPE-C 16PIN / 24PIN; Gender: Female; Current Rating: 5 Amp; Voltage Rating: 3.3V - 48V; Pin Number: 16; ComponentLink1Description: lcsc; ComponentLink1URL: https://www.lcsc.com/product-detail/USB-Connectors_SHOU-HAN-TYPE-C-16PIN-2MD-073_C2765186.html; ComponentLink2Description: datasheet 1; ComponentLink2URL: https://www.lcsc.com/datasheet/lcsc_datasheet_2111231930_SHOU-HAN-TYPE-C-16PIN-2MD-073_C2765186.pdf; ComponentLink3Description: datasheet 2; ComponentLink3URL: https://www.digikey.com/en/products/detail/gct/USB4105-GF-A/11198441; ComponentLink4Description: aliexpress; ComponentLink4URL: https://www.aliexpress.com/item/1005006353547160.html?spm=a2g0o.order_list.order_list_main.61.296f18023vUA5z; LCSC Part: C2765186; Stock: ~30
Y1 = TSX-3225 16.0000MF10U-B0: as Y2 on sheet Nova_Board_Sheet; Part Number: TSX-3225 16.0000MF10U-B0; ComponentLink1Description: Datasheet; ComponentLink1URL: https://support.epson.biz/td/api/doc_check.php?dl=brief_TSX-3225&lang=en; ComponentLink2Description: DigiKey Link; ComponentLink2URL: https://www.digikey.com/en/products/detail/epson/TSX-3225-16-0000MF10U-B0/5260851; Frequency Tolerance: ±10ppm; Height - Seated (Max): 0.024" (0.60mm); LastUpdated: 6/3/2024 8:02:15 PM; Lifecycle Status: Active; Load Capacitance: 16pF; Minimum Order: 1; Mounting Type: Surface Mount; Operating Temperature: -10°C ~ 60°C; Package / Case: 4-SMD, No Lead; Packaging: TapeAndReel; PartId: 436; Part Status: Active; Price: 0.20; Series: TSX-3225; Size / Dimension: 0.126" L x 0.098" W (3.20mm x 2.50mm); Supplier 1: DigiKey; Supplier Part Number 1: SER4370CT-ND; Type: MHz Crystal; Value: 8 MHz

## Nets that join several sheets
CLINK_5V_IN: Nova_Board_Sheet (C22.1 FB2.2), Cosmolink_Sheet (C9.2 D3.2 IC1.3 R9.2)
GND: Nova_Board_Sheet (47 pins), Cosmolink_Sheet (30 pins)
NOVA_SWCLK: Nova_Board_Sheet (STM2.76), Cosmolink_Sheet (STM1.26)
NOVA_SWDIO: Nova_Board_Sheet (STM2.72), Cosmolink_Sheet (R7.2 STM1.27)
NOVA_SWO: Nova_Board_Sheet (STM2.89), Cosmolink_Sheet (STM1.31)